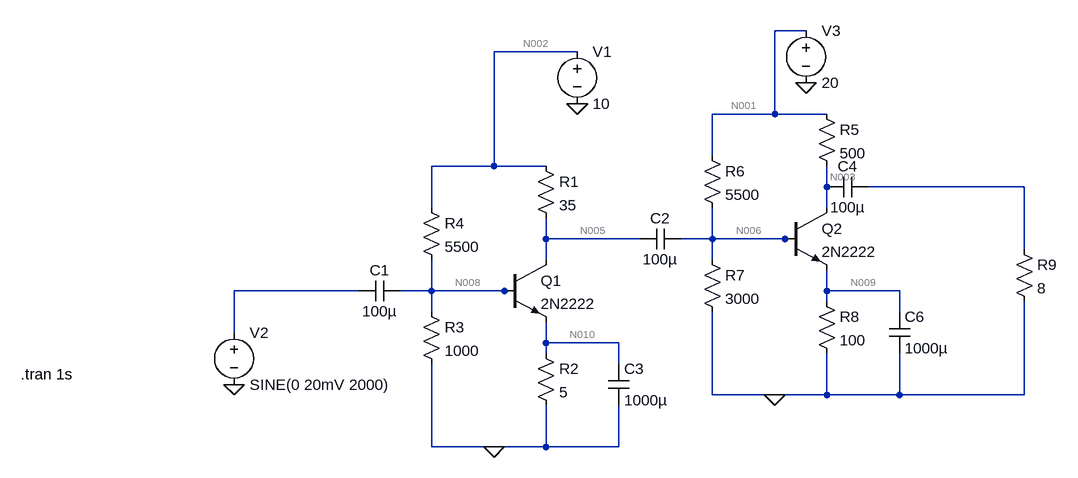
[diagram p0: schematic Cascaded Common Emitter with 2N2222.asc]
Cascaded Common Emitter with 2N2222.asc, the LTspice schematic file:
Version 4
SHEET 1 1016 680
WIRE 624 -288 576 -288
WIRE 272 -256 144 -256
WIRE 576 -160 576 -288
WIRE 576 -160 480 -160
WIRE 656 -160 576 -160
WIRE 480 -96 480 -160
WIRE 144 -80 144 -256
WIRE 144 -80 48 -80
WIRE 224 -80 144 -80
WIRE 656 -48 656 -80
WIRE 960 -48 720 -48
WIRE 48 -16 48 -80
WIRE 656 -16 656 -48
WIRE 224 32 224 0
WIRE 368 32 224 32
WIRE 480 32 480 -16
WIRE 480 32 432 32
WIRE 592 32 480 32
WIRE 608 32 592 32
WIRE 960 48 960 -48
WIRE 224 64 224 32
WIRE 480 64 480 32
WIRE -64 112 -256 112
WIRE 48 112 48 64
WIRE 48 112 0 112
WIRE 160 112 48 112
WIRE 176 112 160 112
WIRE 656 112 656 80
WIRE 768 112 656 112
WIRE 656 128 656 112
WIRE 48 144 48 112
WIRE 768 144 768 112
WIRE -256 176 -256 112
WIRE 224 192 224 160
WIRE 336 192 224 192
WIRE 224 208 224 192
WIRE 336 224 336 192
WIRE 480 272 480 144
WIRE 576 272 480 272
WIRE 656 272 656 208
WIRE 656 272 576 272
WIRE 768 272 768 208
WIRE 768 272 656 272
WIRE 960 272 960 128
WIRE 960 272 768 272
WIRE 48 352 48 224
WIRE 144 352 48 352
WIRE 224 352 224 288
WIRE 224 352 144 352
WIRE 336 352 336 288
WIRE 336 352 224 352
FLAG 272 -176 0
FLAG 144 352 0
FLAG 576 272 0
FLAG 624 -208 0
FLAG -256 256 0
SYMBOL npn 160 64 R0
SYMATTR InstName Q1
SYMATTR Value 2N2222
SYMBOL res 208 -96 R0
SYMATTR InstName R1
SYMATTR Value 35
SYMBOL voltage 272 -272 R0
WINDOW 123 0 0 Left 2
WINDOW 39 0 0 Left 2
SYMATTR InstName V1
SYMATTR Value 10
SYMBOL res 32 -32 R0
SYMATTR InstName R4
SYMATTR Value 5500
SYMBOL res 32 128 R0
SYMATTR InstName R3
SYMATTR Value 1000
SYMBOL res 208 192 R0
SYMATTR InstName R2
SYMATTR Value 5
SYMBOL cap 320 224 R0
SYMATTR InstName C3
SYMATTR Value 1000µ
SYMBOL npn 592 -16 R0
SYMATTR InstName Q2
SYMATTR Value 2N2222
SYMBOL res 640 -176 R0
SYMATTR InstName R5
SYMATTR Value 500
SYMBOL res 464 -112 R0
SYMATTR InstName R6
SYMATTR Value 5500
SYMBOL res 464 48 R0
SYMATTR InstName R7
SYMATTR Value 3000
SYMBOL res 640 112 R0
SYMATTR InstName R8
SYMATTR Value 100
SYMBOL cap 720 -64 R90
WINDOW 0 0 32 VBottom 2
WINDOW 3 32 32 VTop 2
SYMATTR InstName C4
SYMATTR Value 100µ
SYMBOL cap 752 144 R0
SYMATTR InstName C6
SYMATTR Value 1000µ
SYMBOL cap 0 96 R90
WINDOW 0 0 32 VBottom 2
WINDOW 3 32 32 VTop 2
SYMATTR InstName C1
SYMATTR Value 100µ
SYMBOL voltage 624 -304 R0
WINDOW 123 0 0 Left 2
WINDOW 39 0 0 Left 2
SYMATTR InstName V3
SYMATTR Value 20
SYMBOL cap 432 16 R90
WINDOW 0 0 32 VBottom 2
WINDOW 3 32 32 VTop 2
SYMATTR InstName C2
SYMATTR Value 100µ
SYMBOL res 944 32 R0
SYMATTR InstName R9
SYMATTR Value 8
SYMBOL voltage -256 160 R0
WINDOW 123 0 0 Left 2
WINDOW 39 0 0 Left 2
SYMATTR InstName V2
SYMATTR Value SINE(0 20mV 2000)
TEXT -584 240 Left 2 !.tran 1s

The netlist it stands for:
* Cascaded Common Emitter with 2N2222.asc
Q1 N005 N008 N010 0 2N2222
R1 N002 N005 35
V1 N002 0 10
R4 N002 N008 5500
R3 N008 0 1000
R2 N010 0 5
C3 N010 0 1000µ
Q2 N003 N006 N009 0 2N2222
R5 N001 N003 500
R6 N001 N006 5500
R7 N006 0 3000
R8 N009 0 100
C4 N004 N003 100µ
C6 N009 0 1000µ
C1 N008 N007 100µ
V3 N001 0 20
C2 N006 N005 100µ
R9 N004 0 8
V2 N007 0 SINE(0 20mV 2000)
.model NPN NPN
.model PNP PNP
.lib standard.bjt
.tran 1s
.backanno
.end

* Results of the author's LTspice run, read from the files saved beside the schematic
* Operating Point, zero values left out:
*   V(n005) = 7.369 V
*   V(n008) = 1.168 V
*   V(n010) = 378 mV
*   V(n002) = 10 V
*   V(n003) = 3.522 V
*   V(n006) = 4.216 V
*   V(n009) = 3.442 V
*   V(n001) = 20 V
*   Ic(Q2) = 32.96 mA
*   Ib(Q2) = 1.465 mA
*   Ie(Q2) = -34.42 mA
*   Ic(Q1) = 75.17 mA
*   Ib(Q1) = 437.5 µA
*   Ie(Q1) = -75.6 mA
*   I(R8) = 34.42 mA
*   I(R7) = 1.405 mA
*   I(R6) = 2.87 mA
*   I(R5) = 32.96 mA
*   I(R2) = 75.6 mA
*   I(R3) = 1.168 mA
*   I(R4) = 1.606 mA
*   I(R1) = 75.17 mA
*   I(V3) = -35.83 mA
*   I(V1) = -76.77 mA